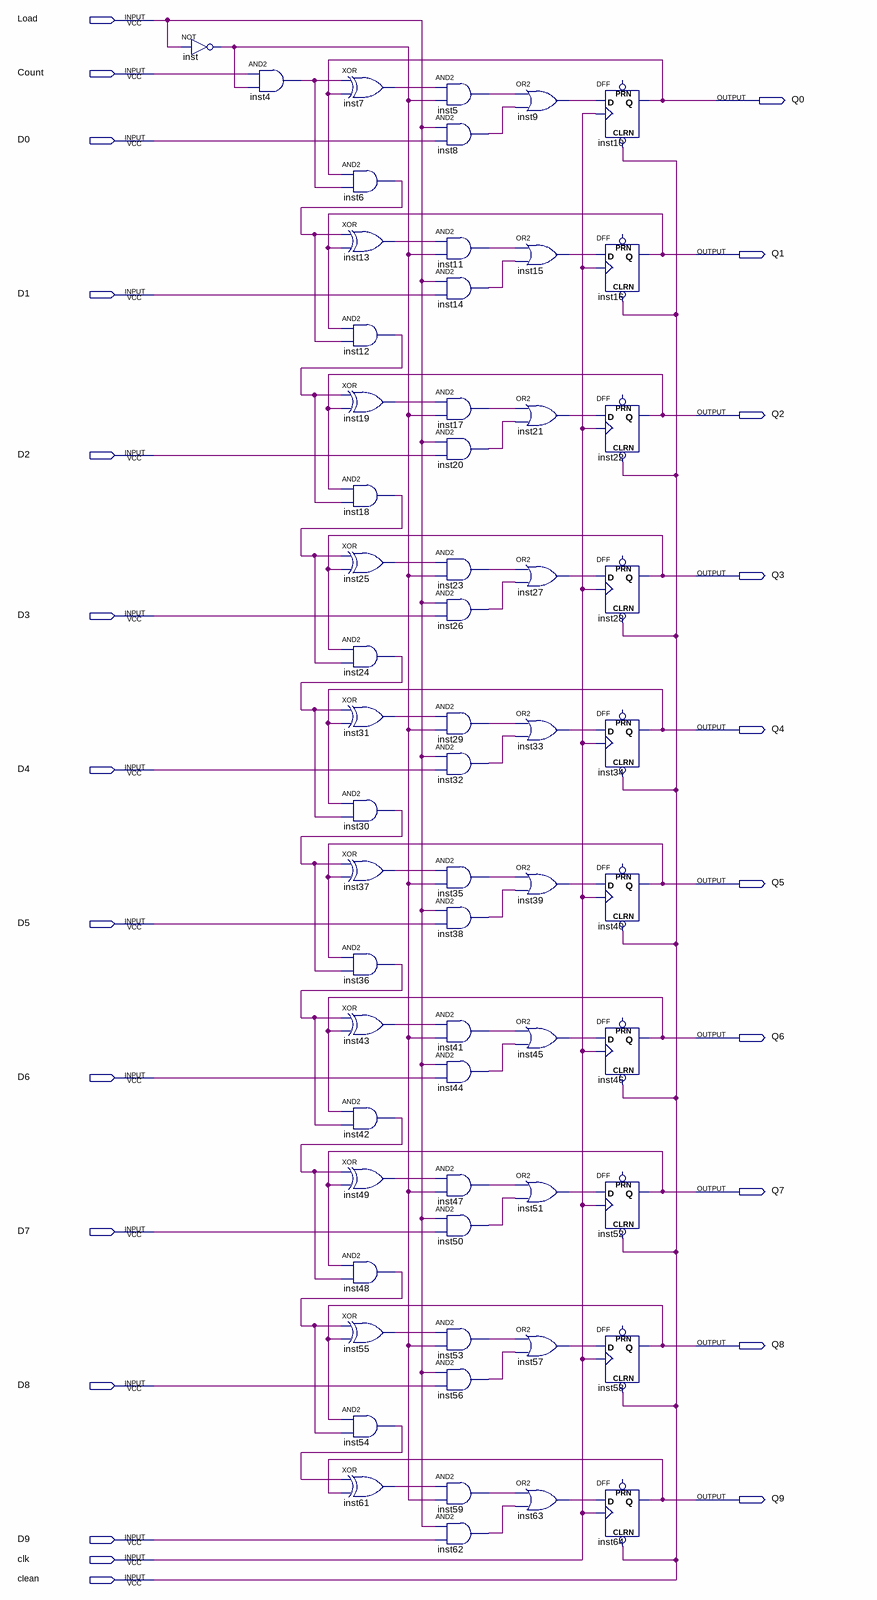
[diagram p0: schematic sheet]
// Quartus schematic 10bitscounter.bdf as structural Verilog: 61 symbols, 24 pins
module \10bitscounter  (
  input  Load,
  input  Count,
  input  D0,
  input  D1,
  input  D2,
  input  D3,
  input  D4,
  input  D5,
  input  D6,
  input  D7,
  input  D8,
  input  D9,
  input  clk,
  input  clean,
  output Q0,
  output Q1,
  output Q2,
  output Q3,
  output Q4,
  output Q5,
  output Q6,
  output Q7,
  output Q8,
  output Q9
);

  wire inst4_out, inst5_out, inst6_out, inst7_out, inst8_out, inst9_out, inst11_out, inst12_out, inst13_out,
       inst14_out, inst15_out, inst17_out, inst18_out, inst19_out, inst20_out, inst21_out, inst23_out,
       inst24_out, inst25_out, inst26_out, inst27_out, inst29_out, inst30_out, inst31_out, inst32_out,
       inst33_out, inst35_out, inst36_out, inst37_out, inst38_out, inst39_out, inst41_out, inst42_out,
       inst43_out, inst44_out, inst45_out, inst47_out, inst48_out, inst49_out, inst50_out, inst51_out,
       inst53_out, inst54_out, inst55_out, inst56_out, inst57_out, inst59_out, inst61_out, inst62_out,
       inst63_out, inst_out;

  not inst (inst_out, Load);
  and inst4 (inst4_out, Count, inst_out);
  xor inst7 (inst7_out, inst4_out, Q0);
  and inst6 (inst6_out, Q0, inst4_out);
  xor inst13 (inst13_out, inst6_out, Q1);
  and inst12 (inst12_out, Q1, inst6_out);
  xor inst19 (inst19_out, inst12_out, Q2);
  and inst18 (inst18_out, Q2, inst12_out);
  xor inst25 (inst25_out, inst18_out, Q3);
  and inst24 (inst24_out, Q3, inst18_out);
  xor inst31 (inst31_out, inst24_out, Q4);
  and inst30 (inst30_out, Q4, inst24_out);
  xor inst37 (inst37_out, inst30_out, Q5);
  and inst36 (inst36_out, Q5, inst30_out);
  xor inst43 (inst43_out, inst36_out, Q6);
  and inst42 (inst42_out, Q6, inst36_out);
  xor inst49 (inst49_out, inst42_out, Q7);
  and inst48 (inst48_out, Q7, inst42_out);
  xor inst55 (inst55_out, inst48_out, Q8);
  and inst54 (inst54_out, Q8, inst48_out);
  xor inst61 (inst61_out, inst54_out, Q9);
  and inst5 (inst5_out, inst7_out, inst_out);
  and inst8 (inst8_out, Load, D0);
  and inst11 (inst11_out, inst13_out, inst_out);
  and inst14 (inst14_out, Load, D1);
  and inst17 (inst17_out, inst19_out, inst_out);
  and inst20 (inst20_out, Load, D2);
  and inst23 (inst23_out, inst25_out, inst_out);
  and inst26 (inst26_out, Load, D3);
  and inst29 (inst29_out, inst31_out, inst_out);
  and inst32 (inst32_out, Load, D4);
  and inst35 (inst35_out, inst37_out, inst_out);
  and inst38 (inst38_out, Load, D5);
  and inst41 (inst41_out, inst43_out, inst_out);
  and inst44 (inst44_out, Load, D6);
  and inst47 (inst47_out, inst49_out, inst_out);
  and inst50 (inst50_out, Load, D7);
  and inst53 (inst53_out, inst55_out, inst_out);
  and inst56 (inst56_out, Load, D8);
  and inst59 (inst59_out, inst61_out, inst_out);
  and inst62 (inst62_out, Load, D9);
  or inst9 (inst9_out, inst5_out, inst8_out);
  or inst15 (inst15_out, inst11_out, inst14_out);
  or inst21 (inst21_out, inst17_out, inst20_out);
  or inst27 (inst27_out, inst23_out, inst26_out);
  or inst33 (inst33_out, inst29_out, inst32_out);
  or inst39 (inst39_out, inst35_out, inst38_out);
  or inst45 (inst45_out, inst41_out, inst44_out);
  or inst51 (inst51_out, inst47_out, inst50_out);
  or inst57 (inst57_out, inst53_out, inst56_out);
  or inst63 (inst63_out, inst59_out, inst62_out);
  DFF inst10 (.CLRN(clean), .CLK(clk), .D(inst9_out), .Q(Q0));  // open: PRN
  DFF inst16 (.CLRN(clean), .CLK(clk), .D(inst15_out), .Q(Q1));  // open: PRN
  DFF inst22 (.CLRN(clean), .CLK(clk), .D(inst21_out), .Q(Q2));  // open: PRN
  DFF inst28 (.CLRN(clean), .CLK(clk), .D(inst27_out), .Q(Q3));  // open: PRN
  DFF inst34 (.CLRN(clean), .CLK(clk), .D(inst33_out), .Q(Q4));  // open: PRN
  DFF inst40 (.CLRN(clean), .CLK(clk), .D(inst39_out), .Q(Q5));  // open: PRN
  DFF inst46 (.CLRN(clean), .CLK(clk), .D(inst45_out), .Q(Q6));  // open: PRN
  DFF inst52 (.CLRN(clean), .CLK(clk), .D(inst51_out), .Q(Q7));  // open: PRN
  DFF inst58 (.CLRN(clean), .CLK(clk), .D(inst57_out), .Q(Q8));  // open: PRN
  DFF inst64 (.CLRN(clean), .CLK(clk), .D(inst63_out), .Q(Q9));  // open: PRN
endmodule
